# Altium schematic sheet P3.schdoc
size 297 x 210 mm; Symbol: Sheet-Symbol_A4; Company: 嘉立创EDA; Version: V1.0; Page Size: A4; @Project Name: VIDEO_CONVERTER; @Page Count: 3; @Update Date: 2024-05-23; @Create Date: 2024-05-21; @Schematic Name: Schematic1; @Page No: 3; @Page Name: P3; Device: Sheet-Symbol_A4
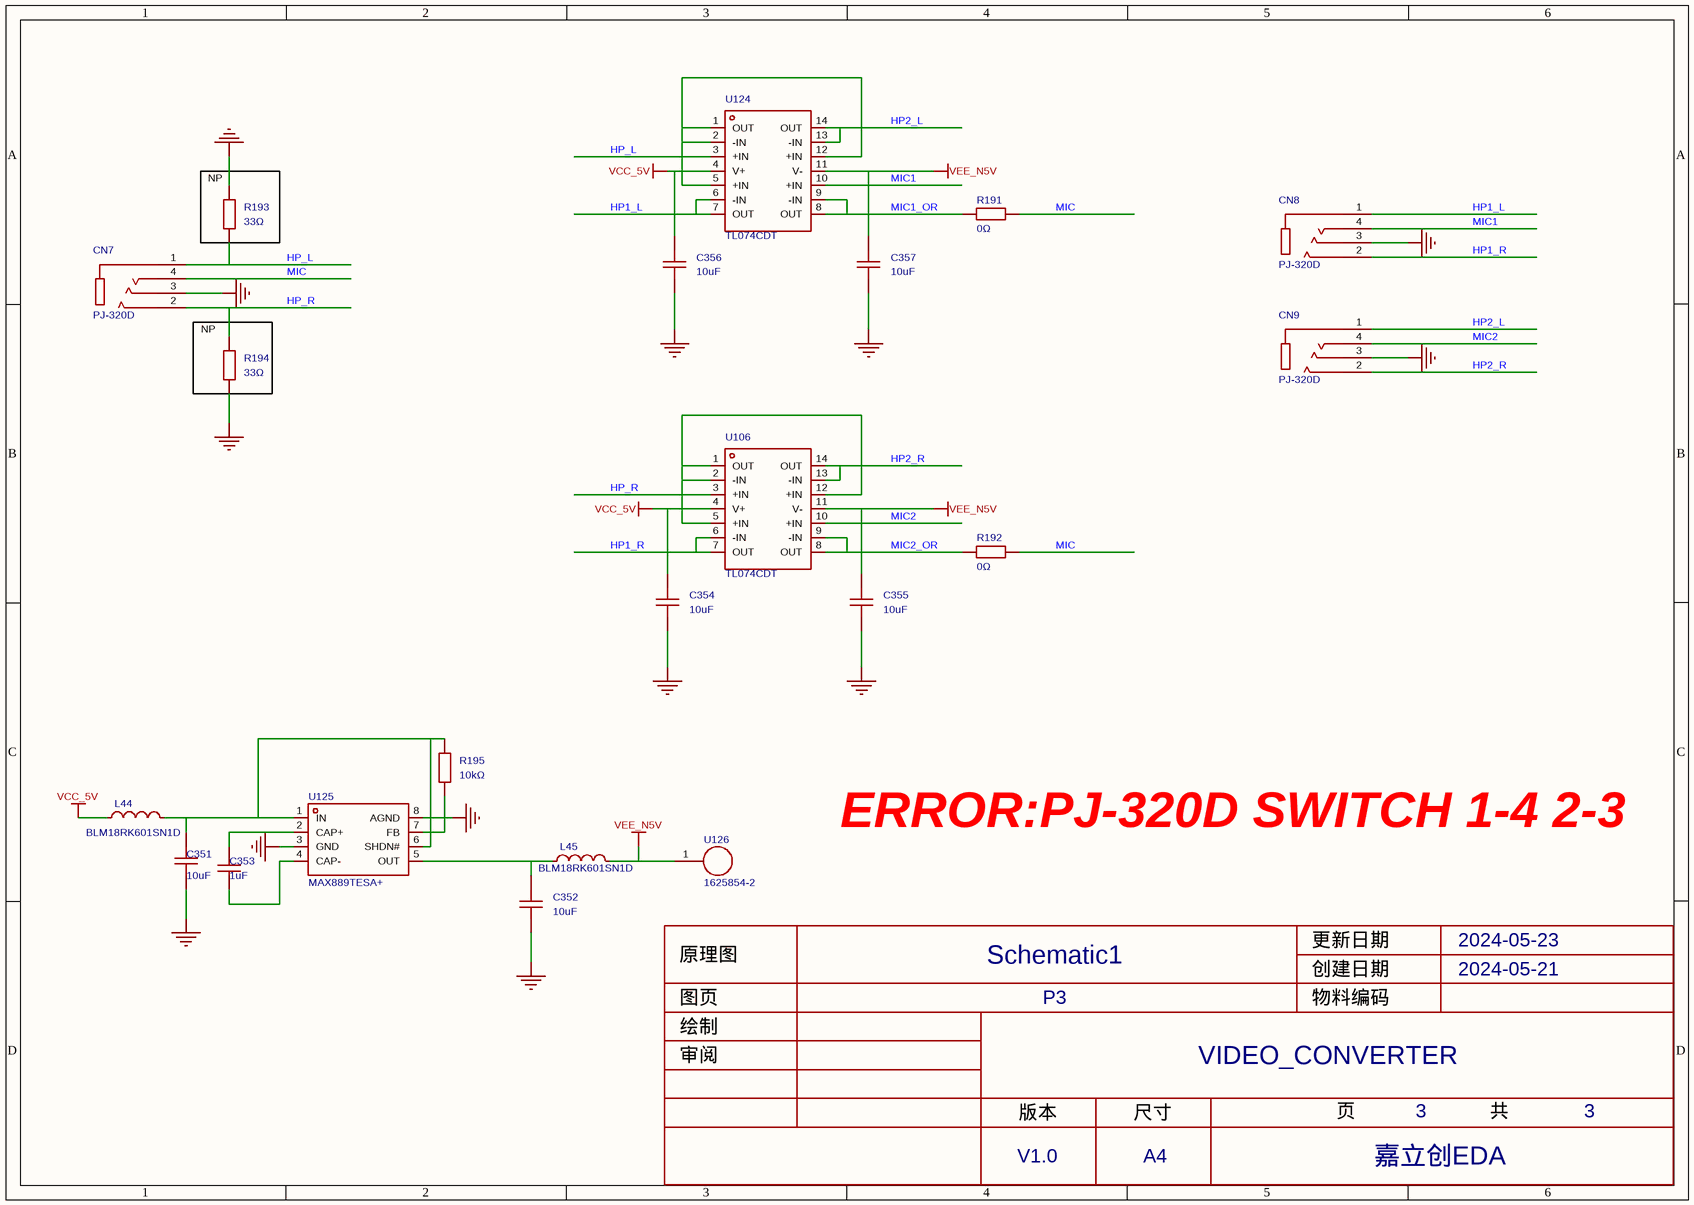
[diagram p0: P3.schdoc]

## Parts
C351  10uF  [C0805]
C352  10uF  [C0805]
C353  1uF  [C0805]
C354  10uF  [C0805]
C355  10uF  [C0805]
C356  10uF  [C0805]
C357  10uF  [C0805]
CN7  PJ-320D  [AUDIO-SMD_PJ-320D]
CN8  PJ-320D  [AUDIO-SMD_PJ-320D]
CN9  PJ-320D  [AUDIO-SMD_PJ-320D]
L44  BLM18RK601SN1D  [L0603]
L45  BLM18RK601SN1D  [L0603]
R191  0Ω  [R0402]
R192  0Ω  [R0402]
R193  33Ω  [R1206]
R194  33Ω  [R1206]
R195  10kΩ  [R0402]
U106  TL074CDT  [SOIC-14_L8.7-W3.9-P1.27-LS6.0-BL]
U124  TL074CDT  [SOIC-14_L8.7-W3.9-P1.27-LS6.0-BL]
U125  MAX889TESA+  [SOIC-8_L4.9-W3.9-P1.27-LS6.0-BL]
U126  1625854-2  [TEST-RING]

## Blocks framed on the sheet
NP: R193
NP: R194

## Nets
GND: C351.1 C352.1 C354.1 C355.1 C356.1 C357.1 CN7.3 CN8.3 CN9.3 R193.2 R194.1 U125.3(GND) U125.8(AGND)
VCC_5V: C354.2 C356.2 L44.1 U106.4(V+) U124.4(V+)
VEE_N5V: C355.2 C357.2 L45.2 U106.11(V-) U124.11(V-) U126.1
HP1_L: CN8.1 U124.6(-IN) U124.7(OUT)
HP1_R: CN8.2 U106.6(-IN) U106.7(OUT)
HP2_L: CN9.1 U124.13(-IN) U124.14(OUT)
HP2_R: CN9.2 U106.13(-IN) U106.14(OUT)
HP_L: CN7.1 R193.1 U124.3(+IN)
HP_R: CN7.2 R194.2 U106.3(+IN)
MIC: CN7.4 R191.2 R192.2
MIC1: CN8.4 U124.10(+IN)
MIC1_OR: R191.1 U124.8(OUT) U124.9(-IN)
MIC2: CN9.4 U106.10(+IN)
MIC2_OR: R192.1 U106.8(OUT) U106.9(-IN)
NetC351_2: C351.2 L44.2 R195.1 U125.1(IN) U125.6(SHDN#)
NetC352_2: C352.2 L45.1 U125.5(OUT)
NetC353_1: C353.1 U125.4(CAP-)
NetC353_2: C353.2 U125.2(CAP+)
NetR195_2: R195.2 U125.7(FB)
NetU106_1: U106.1(OUT) U106.2(-IN) U106.5(+IN) U106.12(+IN)
NetU124_1: U124.1(OUT) U124.2(-IN) U124.5(+IN) U124.12(+IN)

## Notes on the sheet
- ERROR:PJ-320D SWITCH 1-4 2-3
- 更新日期
- 2024-05-23
- 原理图
- 图页
- Schematic1
- P3
- 创建日期
- 物料编码
- 2024-05-21
- 审阅
- 绘制
- VIDEO_CONVERTER
- 版本
- V1.0
- 尺寸
- A4
- 页
- 3
- 嘉立创EDA
- 共

## Library data of the parts
C351 C352 C354-C357 = GRM21BR61H106KE43L: 容值:10uF;精度:±10%;额定电压:50V;材质(温度系数):X5R;; Manufacturer: muRata(村田); AddInBom: yes; ModelId: 1ba041120af144c991958decab20d241; ModelName: C0805_L2.0-W1.3-H1.3; ModelTransform: 78.74,51.181,0,0,0,0,0,0.0005,0; Tolerance: ±10%; Voltage Rated: 50V; Temperature Coefficient: X5R; Symbol: GRM21BR61H106KE43L; Device: GRM21BR61H106KE43L; Supplier: LCSC; Supplier Part: C440198; Manufacturer Part: GRM21BR61H106KE43L; Value: 10uF; JLCPCB Part Class: 基础库; LCSC Part Name: 10uF ±10% 50V; Supplier Footprint: 0805; Datasheet: https://atta.szlcsc.com/upload/public/pdf/source/20230811/95AAE0C9AF55EDC31B7A4D8B733F534E.pdf; ConvertToPcb: yes; FootprintName: C0805
C353 = GCM21BR71H105KA03L: 容值:1uF;精度:±10%;额定电压:50V;材质(温度系数):X7R;; Manufacturer: muRata(村田); AddInBom: yes; ModelId: 1ba041120af144c991958decab20d241; ModelName: C0805_L2.0-W1.3-H1.3; ModelTransform: 78.74,51.181,0,0,0,0,0,0.0005,0; Tolerance: ±10%; Voltage Rated: 50V; Temperature Coefficient: X7R; Symbol: GCM21BR71H105KA03L; Device: GCM21BR71H105KA03L; LCSC Part Name: 1uF ±10% 50V; SupplierPart: C126592; ManufacturerPart: GCM21BR71H105KA03L; Supplier Footprint: 0805; JLCPCB Part Class: 扩展库; Datasheet: https://atta.szlcsc.com/upload/public/pdf/source/20170912/C126592_1505207918399963689.pdf; Supplier: LCSC; ConvertToPcb: yes; FootprintName: C0805; Value: 1uF
CN7-CN9 = PJ-320D_C431535: 连接器类型:3.5mm耳机座;额定电流:300mA;额定电压:50V;工作温度范围:-16℃~+65℃;; Manufacturer: SHOU HAN(首韩); AddInBom: yes; ModelId: bd09d36f1dc146ba8e7977b9497f1865; ModelName: AUDIO-SMD_L12.1-W6.1-H5.0-4P; ModelTransform: 314.96,555.117,0,0,0,0,0.001,87.24,-27.559; Current Rating (Max): 300mA; Voltage Rating (Max): 50V; Symbol: PJ-320D; Device: PJ-320D_C431535; LCSC Part Name: 3.5mm耳机座; SupplierPart: C431535; ManufacturerPart: PJ-320D; Supplier Footprint: SMD; JLCPCB Part Class: 扩展库; Datasheet: https://atta.szlcsc.com/upload/public/pdf/source/20190925/C431535_8B274506621F6117FB020BF07A197848.pdf; Supplier: LCSC; ConvertToPcb: yes; FootprintName: AUDIO-SMD_PJ-320D; Connector Type: 3.5mm耳机座; Operating Temperature Range: -16℃~+65℃
L44 L45 = BLM18RK601SN1D: 标称阻抗@测试频率:600Ω@100MHz;误差:±25%;直流电阻(RDC):600mΩ;; Manufacturer: muRata(村田); AddInBom: yes; ModelId: 2bc5ec593d464d6ba9807aec0b5673c2; ModelName: L0603_L1.6-W0.8-H0.5_BEAD; ModelTransform: 62.992,31.496,0,180,0,0,0.094,0.629,0; Tolerance: ±25%; DC Resistance: 600mΩ; Current Rating: 200mA; Circuits: 1; Device: BLM18RK601SN1D; Symbol: BLM18RK601SN1D; LCSC Part Name: 单路 0603磁珠 阻抗600Ω@100MHz; SupplierPart: C88987; ManufacturerPart: BLM18RK601SN1D; Supplier Footprint: 0603; JLCPCB Part Class: 扩展库; Datasheet: https://atta.szlcsc.com/upload/public/pdf/source/20180329/C160981_FD3C2D2622A377E203B89F4AA32B0741.pdf; Supplier: LCSC; ConvertToPcb: yes; FootprintName: L0603; Impedance @ Frequency: 600Ω@100MHz
R191 R192 = RC0402FR-070RL: 电阻类型:厚膜电阻;阻值:0Ω;精度:±1%;功率:62.5mW;最大工作电压:50V;温度系数:-;; Manufacturer: YAGEO(国巨); AddInBom: yes; ModelId: 671aefced39d4c318694bba8bd8efd39; ModelName: R0402_L1.0-W0.5-H0.5; ModelTransform: 39.37,19.685,0,0,0,0,0,0.0005,0; Tolerance: ±1%; Power(Watts): 62.5mW; Overload Voltage (Max): 50V; Symbol: RC0402FR-070RL; Device: RC0402FR-070RL; LCSC Part Name: 厚膜电阻 0Ω ±1% 62.5mW; SupplierPart: C106231; ManufacturerPart: RC0402FR-070RL; Supplier Footprint: 0402; JLCPCB Part Class: 扩展库; Datasheet: https://atta.szlcsc.com/upload/public/pdf/source/20180927/C295883_E8D83085EA81BD7DE0B2B681138C15EE.pdf; Supplier: LCSC; ConvertToPcb: yes; FootprintName: R0402; Type: 厚膜电阻; Value: 0Ω; Temperature Coefficient: -; Operating Temperature Range: -55℃~+155℃
R193 R194 = 1206W4F330JT5E: 电阻类型:厚膜电阻;阻值:33Ω;精度:±1%;功率:250mW;最大工作电压:200V;温度系数:±200ppm/℃;; Manufacturer: UNI-ROYAL(厚声); Symbol: 1206W4F160JT5E; AddInBom: yes; ModelId: 89a1f13db2384da588040e0b3c55bf66; ModelName: R1206_L3.2-W1.6-H0.6; ModelTransform: 125.984,62.992,0,0,0,0,0,0,0; Tolerance: ±1%; Power(Watts): 250mW; Overload Voltage (Max): 200V; Device: 1206W4F330JT5E; Supplier: LCSC; Manufacturer Part: 1206W4F330JT5E; Supplier Part: C18005; Value: 33Ω; JLCPCB Part Class: Extended Part; LCSC Part Name: 33Ω ±1% 250mW 厚膜电阻; Supplier Footprint: 1206; Datasheet: https://atta.szlcsc.com/upload/public/pdf/source/20200306/C422600_1E6D84923E4A46A82E41ADD87F860B5C.pdf; ConvertToPcb: yes; FootprintName: R1206; Type: 厚膜电阻; Temperature Coefficient: ±200ppm/℃; Operating Temperature Range: -55℃~+155℃
R195 = RC0402FR-0710KL: 电阻类型:厚膜电阻;阻值:10kΩ;精度:±1%;功率:62.5mW;最大工作电压:50V;温度系数:±100ppm/℃;; Manufacturer: YAGEO(国巨); AddInBom: yes; ModelId: 671aefced39d4c318694bba8bd8efd39; ModelName: R0402_L1.0-W0.5-H0.5; ModelTransform: 39.37,19.685,0,0,0,0,0,0.0005,0; Tolerance: ±1%; Power(Watts): 62.5mW; Overload Voltage (Max): 50V; Symbol: RC0402FR-0710KL; Device: RC0402FR-0710KL; LCSC Part Name: 厚膜电阻 10kΩ ±1% 62.5mW; SupplierPart: C60490; ManufacturerPart: RC0402FR-0710KL; Supplier Footprint: 0402; JLCPCB Part Class: 扩展库; Datasheet: https://atta.szlcsc.com/upload/public/pdf/source/20170925/C131467_1506321478108990263.pdf; Supplier: LCSC; ConvertToPcb: yes; FootprintName: R0402; Type: 厚膜电阻; Value: 10kΩ; Temperature Coefficient: ±100ppm/℃; Operating Temperature Range: -55℃~+155℃
U106 U124 = TL074CDT: 增益带宽积(GBP):3MHz;输入偏置电流(Ib):30pA;输入失调电压(Vos):3mV;压摆率(SR):13V/us;; Manufacturer: ST(意法半导体); AddInBom: yes; ModelId: 8dbf5b715d42428c85558507ae5a252b; ModelName: SOIC-14_L8.6-W3.9-H1.8-LS6.0-P1.27; ModelTransform: 338.583,236.22,0,0,0,0,0,-0.001,0; Gain Bandwidth Product(GBP): 3MHz; Current - Input Bias(Ib): 30pA; Voltage - Input Offset(Vos): 3mV; Slew Rate(SR): 13V/us; Supply Current Per Channel: 1.4mA; Symbol: TL074CDT; Device: TL074CDT; LCSC Part Name: TL074CDT; SupplierPart: C6963; ManufacturerPart: TL074CDT; Supplier Footprint: SOIC-14; JLCPCB Part Class: 扩展库; Datasheet: https://atta.szlcsc.com/upload/public/pdf/source/20180511/C79668_B9AF02D8BC6CC04960E26C1CA949D7C5.pdf; Supplier: LCSC; ConvertToPcb: yes; FootprintName: SOIC-14_L8.7-W3.9-P1.27-LS6.0-BL; Operating Temperature: 0℃~+70℃
U125 = MAX889TESA+: 功能类型:降压型;输出类型:可调;输入电压:2.7V~5.5V;输出电压:-5.5V~-2.5V;输出电流(最大值):200mA;; Manufacturer: ADI(亚德诺)/MAXIM(美信); AddInBom: yes; ModelId: e81d2f7d937b4a6ab1dca543ff5d56a4; ModelName: SOIC-8_L4.9-W3.9-H1.7-LS6.0-P1.27; ModelTransform: 189.751,236.22,0,0,0,0,0.0005,0.0005,0; Function: 降压型; Output Type: 可调; Output Current (Max): 200mA; Switching Frequency: 2MHz; Synchronous Rectification: 否; Number of Outputs: 1; Switch tube (built-in/external): 内置; Symbol: MAX889TESA+; Device: MAX889TESA+; LCSC Part Name: MAX889TESA+; SupplierPart: C1355341; ManufacturerPart: MAX889TESA+; Supplier Footprint: SOIC-8; JLCPCB Part Class: 扩展库; Datasheet: https://atta.szlcsc.com/upload/public/pdf/source/20171204/C143609_15123772899051162756.pdf; Supplier: LCSC; ConvertToPcb: yes; FootprintName: SOIC-8_L4.9-W3.9-P1.27-LS6.0-BL; Input Voltage: 2.7V~5.5V; Output Voltage: -5.5V~-2.5V; Operating Temperature: -40℃~+85℃@(TA); Topology: -
U126 = 1625854-2: PC 测试点 表面贴装; Manufacturer: TE Connectivity(泰科电子); AddInBom: yes; ModelId: bfbdca37223f416e80526217787ecd09; ModelTransform: 78.74,49.2125,0,0,0,0,0,0,0; Symbol: 1625854-2; Device: 1625854-2; LCSC Part Name: 1625854-2; SupplierPart: C306063; ManufacturerPart: 1625854-2; Supplier Footprint: -; JLCPCB Part Class: 扩展库; Datasheet: https://atta.szlcsc.com/upload/public/pdf/source/20221209/97BE41A51F1CE3ECBA7573F39B62A732.pdf; Supplier: LCSC; ConvertToPcb: yes; FootprintName: TEST-RING; ModelName: TEST-RING